# EAGLE schematic full_motor (EAGLE 7.5.0)
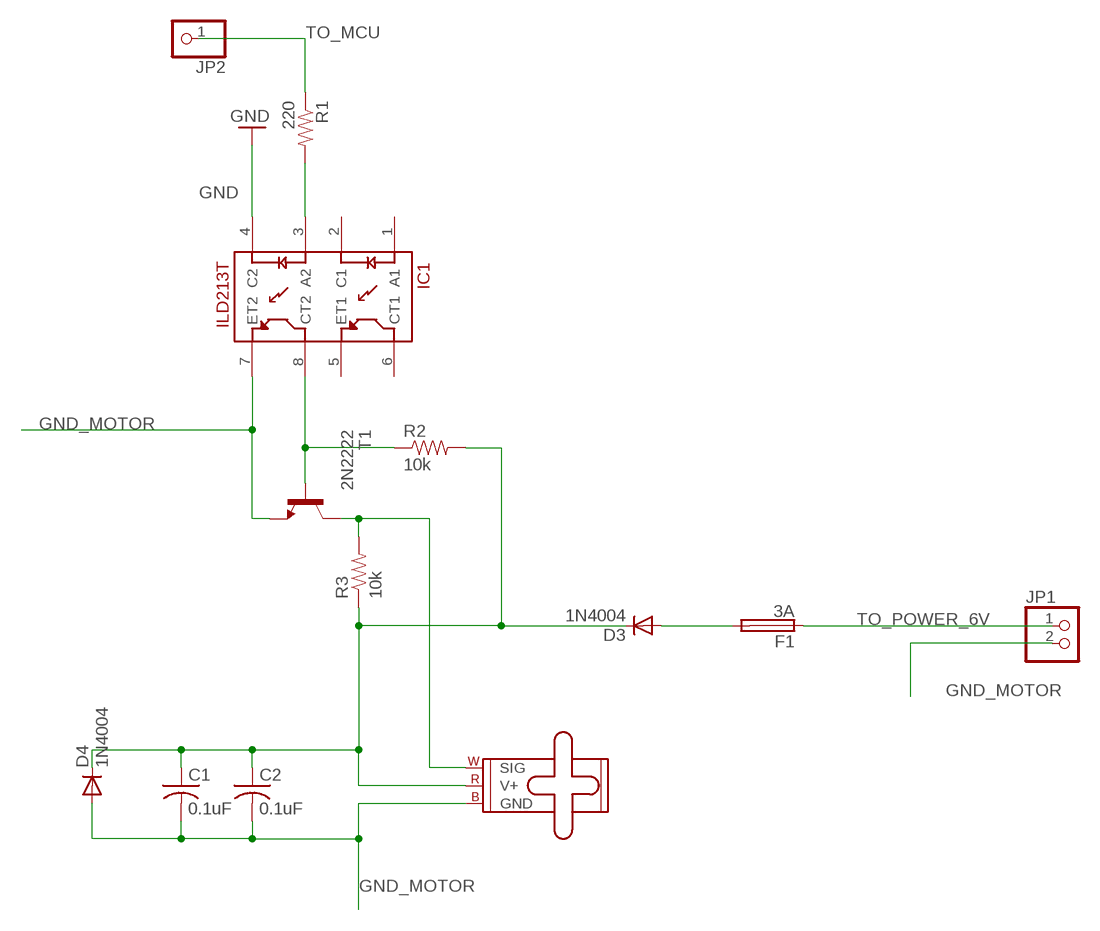
[diagram p0: schematic, sheet 1]

## Parts
C1  0.1uF  C-US025-024X044  [C025-024X044]
C2  0.1uF  C-US025-024X044  [C025-024X044]
D3  1N4004  [DO41-10]
D4  1N4004  [DO41-10]
F1  3A  TE5  [TE5]
IC1  ILD213T  [SO08]
JP1  PINHD-1X2  [1X02]
JP2  PINHD-1X1  [1X01]
M1  SMALL_SERVO  [1X03]
R1  220  RESISTOR1206  [1206]
R2  10k  RESISTOR1206  [1206]
R3  10k  RESISTOR1206  [1206]
T1  2N2222  [TO92-EBC-OVAL]

## Nets
GND: IC1.4(C2)
GND_MOTOR: C1.2 C2.2 D4.A IC1.7(ET2) JP1.2 M1.3(GND) T1.E
N$1: IC1.3(A2) R1.2
N$2: C1.1 C2.1 D3.C D4.C M1.2(V+) R2.2 R3.1
N$3: IC1.8(CT2) R2.1 T1.B
N$4: D3.A F1.2
N$6: M1.1(SIG) R3.2 T1.C
TO_MCU: JP2.1 R1.1
TO_POWER_6V: F1.1 JP1.1
Unconnected: IC1.1(A1) IC1.2(C1) IC1.5(ET1) IC1.6(CT1)

## Library data of the parts
C1 C2 = adafruit:C-US: CAPACITOR, American symbol
D3 D4 = adafruit:1N4004: DIODE General purpose 1N400x type rectifier (With bigger pads) http://www.ladyada.net/library/pcb/eaglelibrary.html
F1 = fuse:TE5: FUSE Wickmann; OC_FARNELL: unknown; OC_NEWARK: unknown
IC1 = SparkFun-DiscreteSemi:ILD213T: Dual optoisolator.
JP1 = pinhead:PINHD-1X2: PIN HEADER
JP2 = pinhead:PINHD-1X1: PIN HEADER
M1 = SparkFun-Electromechanical:SMALL_SERVO: Small servo motor This is the small servo used in the SIK. SKU: ROB-09065
R1-R3 = SparkFun-Passives:RESISTOR: Resistor Basic schematic elements and footprints for 0603, 1206, and PTH resistors.
T1 = adafruit:2N2222: NPN TRANSISTOR Big oval pads